# Altium schematic sheet PTF-771_PTF-77.schdoc
size 127 x 99 mm
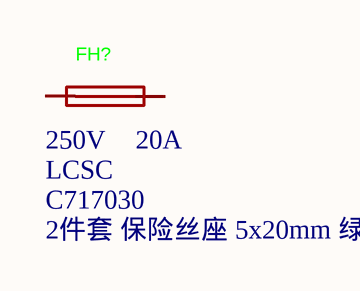
[diagram p0: PTF-771_PTF-77.schdoc]

## Parts
FH?  LCSC Part Name: 2件套 保险丝座 5x20mm 绿色  Supplier Part: C717030  Supplier: LCSC  Voltage Rating: 250V  Current Rating: 20A  [FUSE-TH_L24.4-W9.4-P22.60]  (hidden comment: PTF-77)

## Nets

Not connected (* = marked no-connect by the designer): FH? 1 2

## Library data of the parts
FH? = PTF-77: Manufacturer: XFCN(兴飞); Add into BOM: yes; Fuseholder Type: Bracket type; Number of Circuits: 1; Fuse Type: Cylindrical; Fuse Diameter (φD): 5mm; Fuse Length: 20mm; Symbol: PTF-77; Device: PTF-77; Manufacturer Part: PTF-77; Supplier Footprint: 插件,P=22.5mm; JLCPCB Part Class: Extended Part; Datasheet: https://item.szlcsc.com/datasheet/PTF-77/757629.html; Convert to PCB: yes